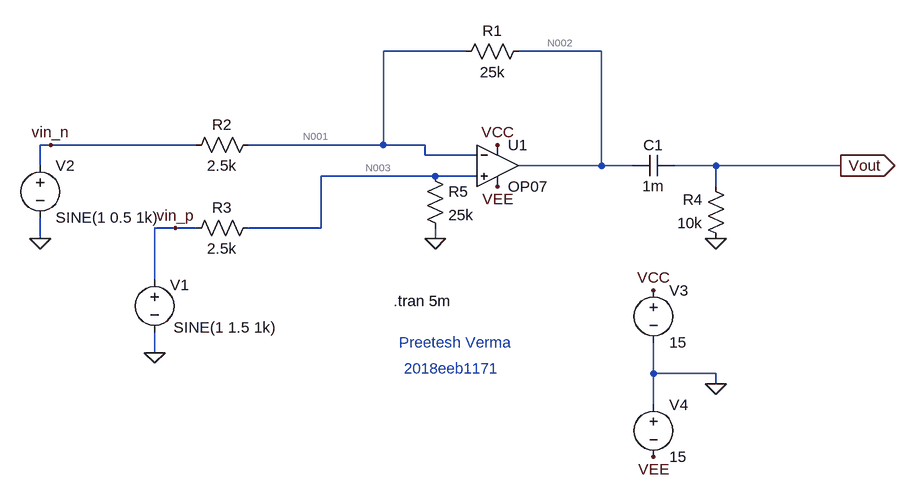
[diagram p0: schematic IdealOPamp_subtractor.asc]
IdealOPamp_subtractor.asc, the LTspice schematic file:
Version 4
SHEET 1 1060 680
WIRE 160 -208 32 -208
WIRE 368 -208 240 -208
WIRE -480 -64 -496 -64
WIRE -256 -64 -480 -64
WIRE 32 -64 32 -208
WIRE 32 -64 -176 -64
WIRE 96 -64 32 -64
WIRE 96 -48 96 -64
WIRE 176 -48 96 -48
WIRE -496 -32 -496 -64
WIRE 368 -32 368 -208
WIRE 368 -32 240 -32
WIRE 416 -32 368 -32
WIRE 544 -32 480 -32
WIRE 736 -32 544 -32
WIRE 112 -16 -64 -16
WIRE 176 -16 112 -16
WIRE 544 0 544 -32
WIRE -288 64 -320 64
WIRE -256 64 -288 64
WIRE -64 64 -64 -16
WIRE -64 64 -176 64
WIRE -496 80 -496 48
WIRE 112 80 112 64
WIRE -320 144 -320 64
WIRE -320 256 -320 224
WIRE 448 288 448 240
WIRE 544 288 448 288
WIRE 544 304 544 288
WIRE 448 336 448 288
FLAG 736 -32 Vout
IOPIN 736 -32 Out
FLAG 544 304 0
FLAG 448 160 VCC
FLAG 208 -64 VCC
FLAG 448 416 VEE
FLAG 208 0 VEE
FLAG -496 80 0
FLAG -320 256 0
FLAG 112 80 0
FLAG 544 80 0
FLAG -480 -64 vin_n
FLAG -288 64 vin_p
SYMBOL res 256 -224 R90
WINDOW 0 0 56 VBottom 2
WINDOW 3 32 56 VTop 2
SYMATTR InstName R1
SYMATTR Value 25k
SYMBOL res -160 -80 R90
WINDOW 0 0 56 VBottom 2
WINDOW 3 32 56 VTop 2
SYMATTR InstName R2
SYMATTR Value 2.5k
SYMBOL res -160 48 R90
WINDOW 0 0 56 VBottom 2
WINDOW 3 32 56 VTop 2
SYMATTR InstName R3
SYMATTR Value 2.5k
SYMBOL voltage -320 128 R0
WINDOW 0 24 24 Left 2
WINDOW 3 29 89 Left 2
WINDOW 123 0 0 Left 0
WINDOW 39 0 0 Left 0
SYMATTR InstName V1
SYMATTR Value SINE(1 1.5 1k)
SYMBOL voltage -496 -48 R0
WINDOW 123 0 0 Left 0
WINDOW 39 0 0 Left 0
SYMATTR InstName V2
SYMATTR Value SINE(1 0.5 1k)
SYMBOL Opamps\\OP07 208 -96 R0
SYMATTR InstName U1
SYMBOL voltage 448 144 R0
WINDOW 123 0 0 Left 0
WINDOW 39 0 0 Left 0
SYMATTR InstName V3
SYMATTR Value 15
SYMBOL voltage 448 320 R0
WINDOW 123 0 0 Left 0
WINDOW 39 0 0 Left 0
SYMATTR InstName V4
SYMATTR Value 15
SYMBOL res 560 96 R180
WINDOW 0 36 76 Left 2
WINDOW 3 36 40 Left 2
SYMATTR InstName R4
SYMATTR Value 10k
SYMBOL cap 480 -48 R90
WINDOW 0 0 32 VBottom 2
WINDOW 3 32 32 VTop 2
SYMATTR InstName C1
SYMATTR Value 1m
SYMBOL res 96 -32 R0
SYMATTR InstName R5
SYMATTR Value 25k
TEXT 48 176 Left 2 !.tran 5m
TEXT 56 240 Left 2 ;Preetesh Verma
TEXT 64 280 Left 2 ;2018eeb1171

The netlist it stands for:
* IdealOPamp_subtractor.asc
R1 N002 N001 25k
R2 N001 vin_n 2.5k
R3 N003 vin_p 2.5k
V1 vin_p 0 SINE(1 1.5 1k)
V2 vin_n 0 SINE(1 0.5 1k)
XU1 N003 N001 VCC VEE N002 LT1001  ; OP07, pins In+ In- V+ V- OUT
V3 VCC 0 15
V4 0 VEE 15
R4 0 Vout 10k
C1 Vout N002 1m
R5 N003 0 25k
.tran 5m
* Preetesh Verma
* 2018eeb1171
.lib LTC.lib
.backanno
.end

* Results of the author's LTspice run, read from the files saved beside the schematic
* Operating Point, zero values left out:
*   V(n002) = 17.95 nV
*   V(n001) = 909.1 mV
*   V(vin_n) = 1 V
*   V(n003) = 909.1 mV
*   V(vin_p) = 1 V
*   V(vcc) = 15 V
*   V(vee) = -15 V
*   I(R5) = 36.36 µA
*   I(R3) = -36.36 µA
*   I(R2) = -36.36 µA
*   I(R1) = -36.36 µA
*   I(V4) = -2.268 mA
*   I(V3) = -2.232 mA
*   I(V2) = -36.36 µA
*   I(V1) = -36.36 µA
*   Ix(u1:1) = 1.623 pA
*   Ix(u1:2) = 1.623 pA
*   Ix(u1:3) = 2.232 mA
*   Ix(u1:4) = -2.268 mA
*   Ix(u1:5) = 36.36 µA
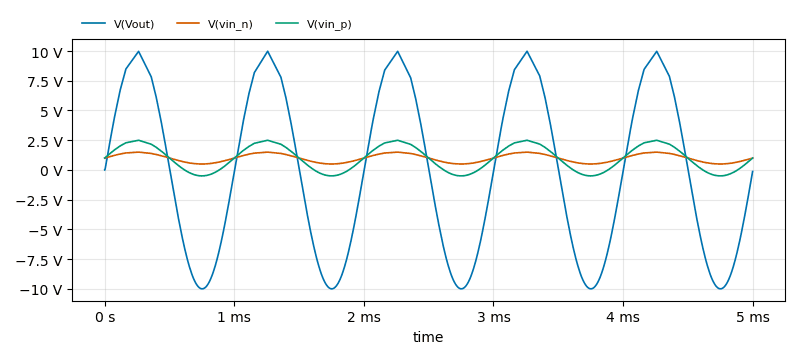
[diagram p1: Transient Analysis of IdealOPamp_subtractor.asc, plotted from the saved traces]
* Transient Analysis, 1 run:
*   V(Vout): min -9.996 V, max 9.981 V, average -66.07 mV, rms 7.003 V, last -132.4 mV
*   V(vin_n): min 500 mV, max 1.499 V, average 996.7 mV, rms 1.056 V, last 1 V
*   V(vin_p): min -500 mV, max 2.497 V, average 990.1 mV, rms 1.444 V, last 1 V